# Altium schematic sheet Sheet1.SchDoc
size A4; SheetNumber: 1; SheetTotal: 1
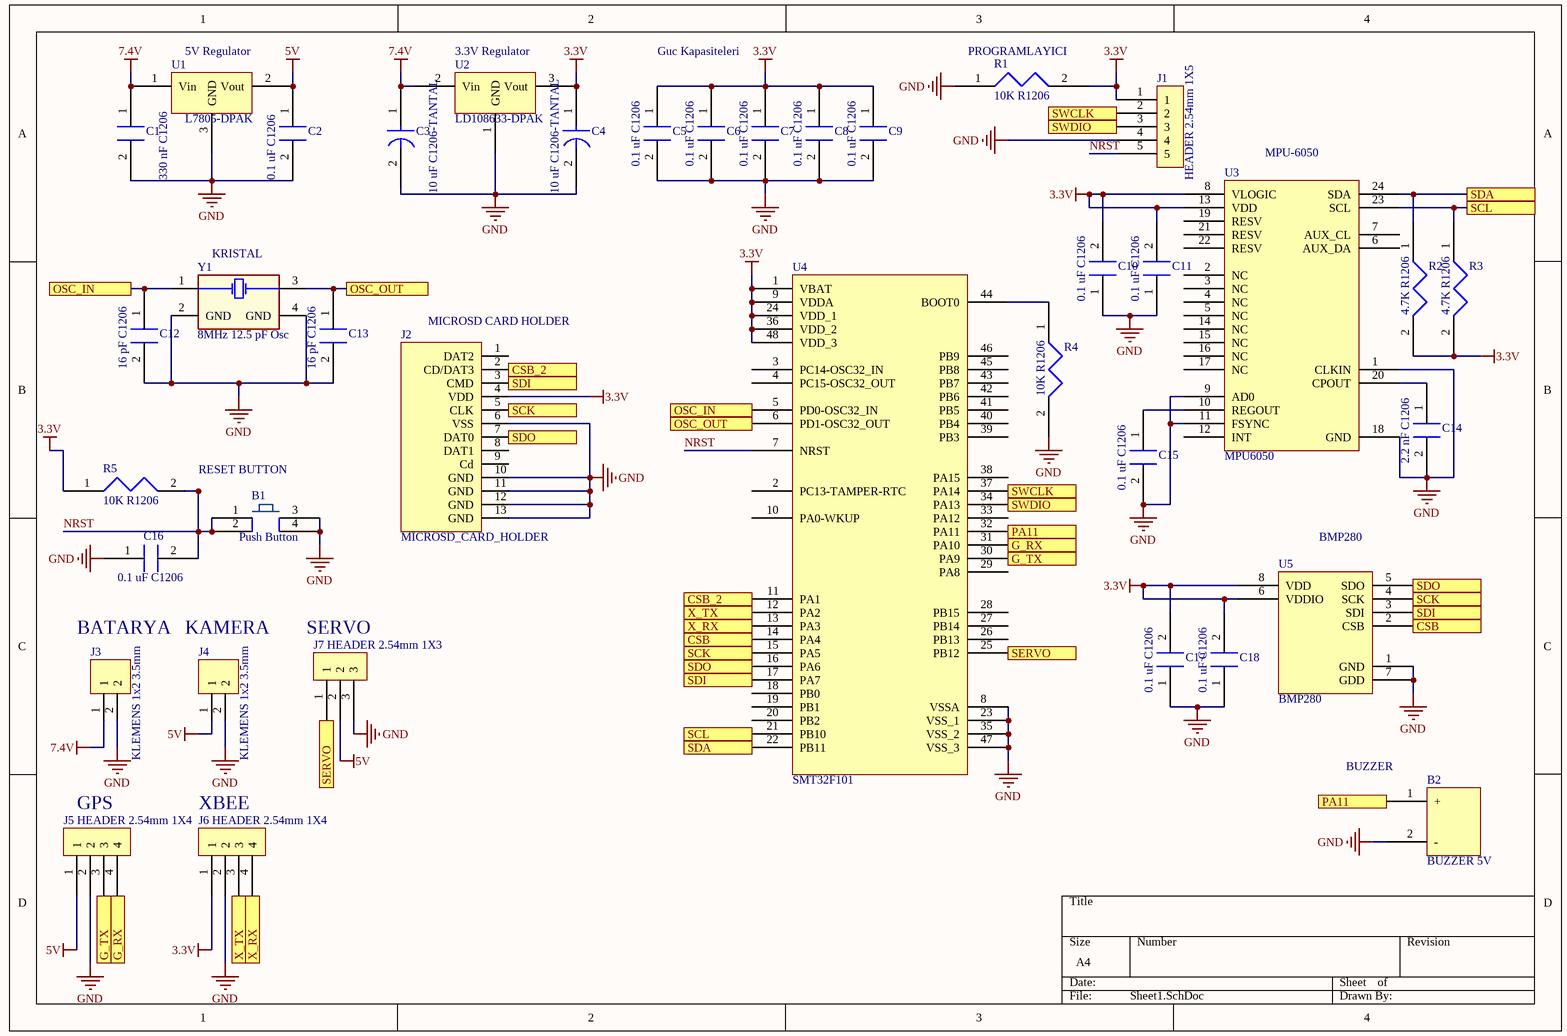
[diagram p0: Sheet1.SchDoc]

## Parts
B1  Push Button  [Push Button]
B2  BUZZER 5V  [BUZZER 5V]
C1  330 nF C1206  [C1206]
C2  0.1 uF C1206  [C1206]
C3  10 uF C1206-TANTAL  [C1206-TANTAL]
C4  10 uF C1206-TANTAL  [C1206-TANTAL]
C5  0.1 uF C1206  [C1206]
C6  0.1 uF C1206  [C1206]
C7  0.1 uF C1206  [C1206]
C8  0.1 uF C1206  [C1206]
C9  0.1 uF C1206  [C1206]
C10  0.1 uF C1206  [C1206]
C11  0.1 uF C1206  [C1206]
C12  16 pF C1206  [C1206]
C13  16 pF C1206  [C1206]
C14  2.2 nF C1206  [C1206]
C15  0.1 uF C1206  [C1206]
C16  0.1 uF C1206  [C1206]
C17  0.1 uF C1206  [C1206]
C18  0.1 uF C1206  [C1206]
J1  HEADER 2.54mm 1X5  [HEADER 2.54mm 1X5]
J2  MICROSD_CARD_HOLDER  [MICROSD_CARD_HOLDER]
J3  KLEMENS 1x2 3.5mm  [Klemens 1x2 3.5mm]
J4  KLEMENS 1x2 3.5mm  [Klemens 1x2 3.5mm]
J5  HEADER 2.54mm 1X4  [HEADER 2.54mm 1X4]
J6  HEADER 2.54mm 1X4  [HEADER 2.54mm 1X4]
J7  HEADER 2.54mm 1X3  [HEADER 2.54mm 1X3]
R1  10K R1206  [R1206 RESISTOR]
R2  4.7K R1206  [R1206 RESISTOR]
R3  4.7K R1206  [R1206 RESISTOR]
R4  10K R1206  [R1206 RESISTOR]
R5  10K R1206  [R1206 RESISTOR]
U1  L7805-DPAK  [DPAK228P972X230-3N]
U2  LD108633-DPAK  [DPAK228P972X230-3N]
U3  MPU6050  [QFN50P400X400X95_HS-25N]
U4  SMT32F101  [LQFP48-STM]
U5  BMP280  [BMP280]
Y1  8MHz 12.5 pF Osc  [8 MHz Osc]

## Ports
CSB, CSB_2, G_RX, G_TX, OSC_IN, OSC_OUT, PA11, SCK, SCL, SDA, SDI, SDO, SERVO, SWCLK, SWDIO, X_RX, X_TX

## Nets
3.3V: C4.1 C5.1 C6.1 C7.1 C8.1 C9.1 C10.2 C11.2 C17.2 C18.2 J1.1 J2.4(VDD) J6.1 R1.2 R2.2 R3.2 R5.1 U2.3(Vout) U3.8(VLOGIC) U3.13(VDD) U4.1(VBAT) U4.9(VDDA) U4.24(VDD_1) U4.36(VDD_2) U4.48(VDD_3) U5.6(VDDIO) U5.8(VDD)
5V: C2.1 J4.1 J5.1 J7.2 U1.2(Vout)
7.4V: C1.1 C3.1 J3.1 U1.1(Vin) U2.2(Vin)
GND: B1.3 B1.4 B2.2(-) C1.2 C2.2 C3.2 C4.2 C5.2 C6.2 C7.2 C8.2 C9.2 C10.1 C11.1 C12.2 C13.2 C14.2 C15.2 C16.1 C17.1 C18.1 J1.4 J2.6(VSS) J2.10(GND) J2.11(GND) J2.12(GND) J2.13(GND) J3.2 J4.2 J5.2 J6.2 J7.3 R1.1 R4.2 U1.3(GND) U2.1(GND) U3.1(CLKIN) U3.9(AD0) U3.11(FSYNC) U3.18(GND) U4.8(VSSA) U4.23(VSS_1) U4.35(VSS_2) U4.47(VSS_3) U5.1(GND) U5.7(GDD) Y1.2(GND) Y1.4(GND)
CSB: U4.14(PA4) U5.2(CSB) ; port CSB
CSB_2: J2.2(CD/DAT3) U4.11(PA1) ; port CSB_2
G_RX: J5.4 U4.31(PA10) ; port G_RX
G_TX: J5.3 U4.30(PA9) ; port G_TX
NRST: B1.1 B1.2 C16.2 J1.5 R5.2 U4.7(NRST)
OSC_IN: C12.1 U4.5(PD0-OSC32_IN) Y1.1 ; port OSC_IN
OSC_OUT: C13.1 U4.6(PD1-OSC32_OUT) Y1.3 ; port OSC_OUT
PA11: B2.1(+) U4.32(PA11) ; port PA11
SCK: J2.5(CLK) U4.15(PA5) U5.4(SCK) ; port SCK
SCL: R3.1 U3.23(SCL) U4.21(PB10) ; port SCL
SDA: R2.1 U3.24(SDA) U4.22(PB11) ; port SDA
SDI: J2.3(CMD) U4.17(PA7) U5.3(SDI) ; port SDI
SDO: J2.7(DAT0) U4.16(PA6) U5.5(SDO) ; port SDO
SERVO: J7.1 U4.25(PB12) ; port SERVO
SWCLK: J1.2 U4.37(PA14) ; port SWCLK
SWDIO: J1.3 U4.34(PA13) ; port SWDIO
X_RX: J6.4 U4.13(PA3) ; port X_RX
X_TX: J6.3 U4.12(PA2) ; port X_TX
NetC14_1: C14.1 U3.20(CPOUT)
NetC15_1: C15.1 U3.10(REGOUT)
NetR4_1: R4.1 U4.44(BOOT0)

Not connected (* = marked no-connect by the designer): J2 1(DAT2) 8(DAT1) 9(Cd); U3 2(NC) 3(NC) 4(NC) 5(NC) 6(AUX_DA) 7(AUX_CL) 12(INT) 14(NC) 15(NC) 16(NC) 17(NC) 19(RESV) 21(RESV) 22(RESV); U4 2(PC13-TAMPER-RTC) 3(PC14-OSC32_IN) 4(PC15-OSC32_OUT) 10(PA0-WKUP) 18(PB0) 19(PB1) 20(PB2) 26(PB13) 27(PB14) 28(PB15) 29(PA8) 33(PA12) 38(PA15) 39(PB3) 40(PB4) 41(PB5) 42(PB6) 43(PB7) 45(PB8) 46(PB9)

## Notes on the sheet
- (near U1) 5V Regulator
- (near U2) 3.3V Regulator
- Guc Kapasiteleri
- (near R1) PROGRAMLAYICI
- (near U3) MPU-6050
- (near Y1) KRISTAL
- (near J2) MICROSD CARD HOLDER
- RESET BUTTON
- (near U5) BMP280
- BATARYA
- KAMERA
- (near J7) SERVO
- BUZZER
- (near J5) GPS
- (near J6) XBEE

## Library data of the parts
B1 = Push Button: Button for Reset
J2 = MICROSD_CARD_HOLDER: MicroSD Card Holder
J3 J4 = KLEMENS 1x2 3.5mm: 1x2 3.5mm Klemens
U1 = L7805-DPAK: L7805 5V REGULATOR
U2 = LD108633-DPAK: 3.3V REGULATOR
U3 = MPU6050: MPU6050 GYRO
U4 = SMT32F101: 48 PINLI MICROISLECI
U5 = BMP280: BMP280 SENSOR